# EAGLE design sensorNode1 (EAGLE 9.6.2)
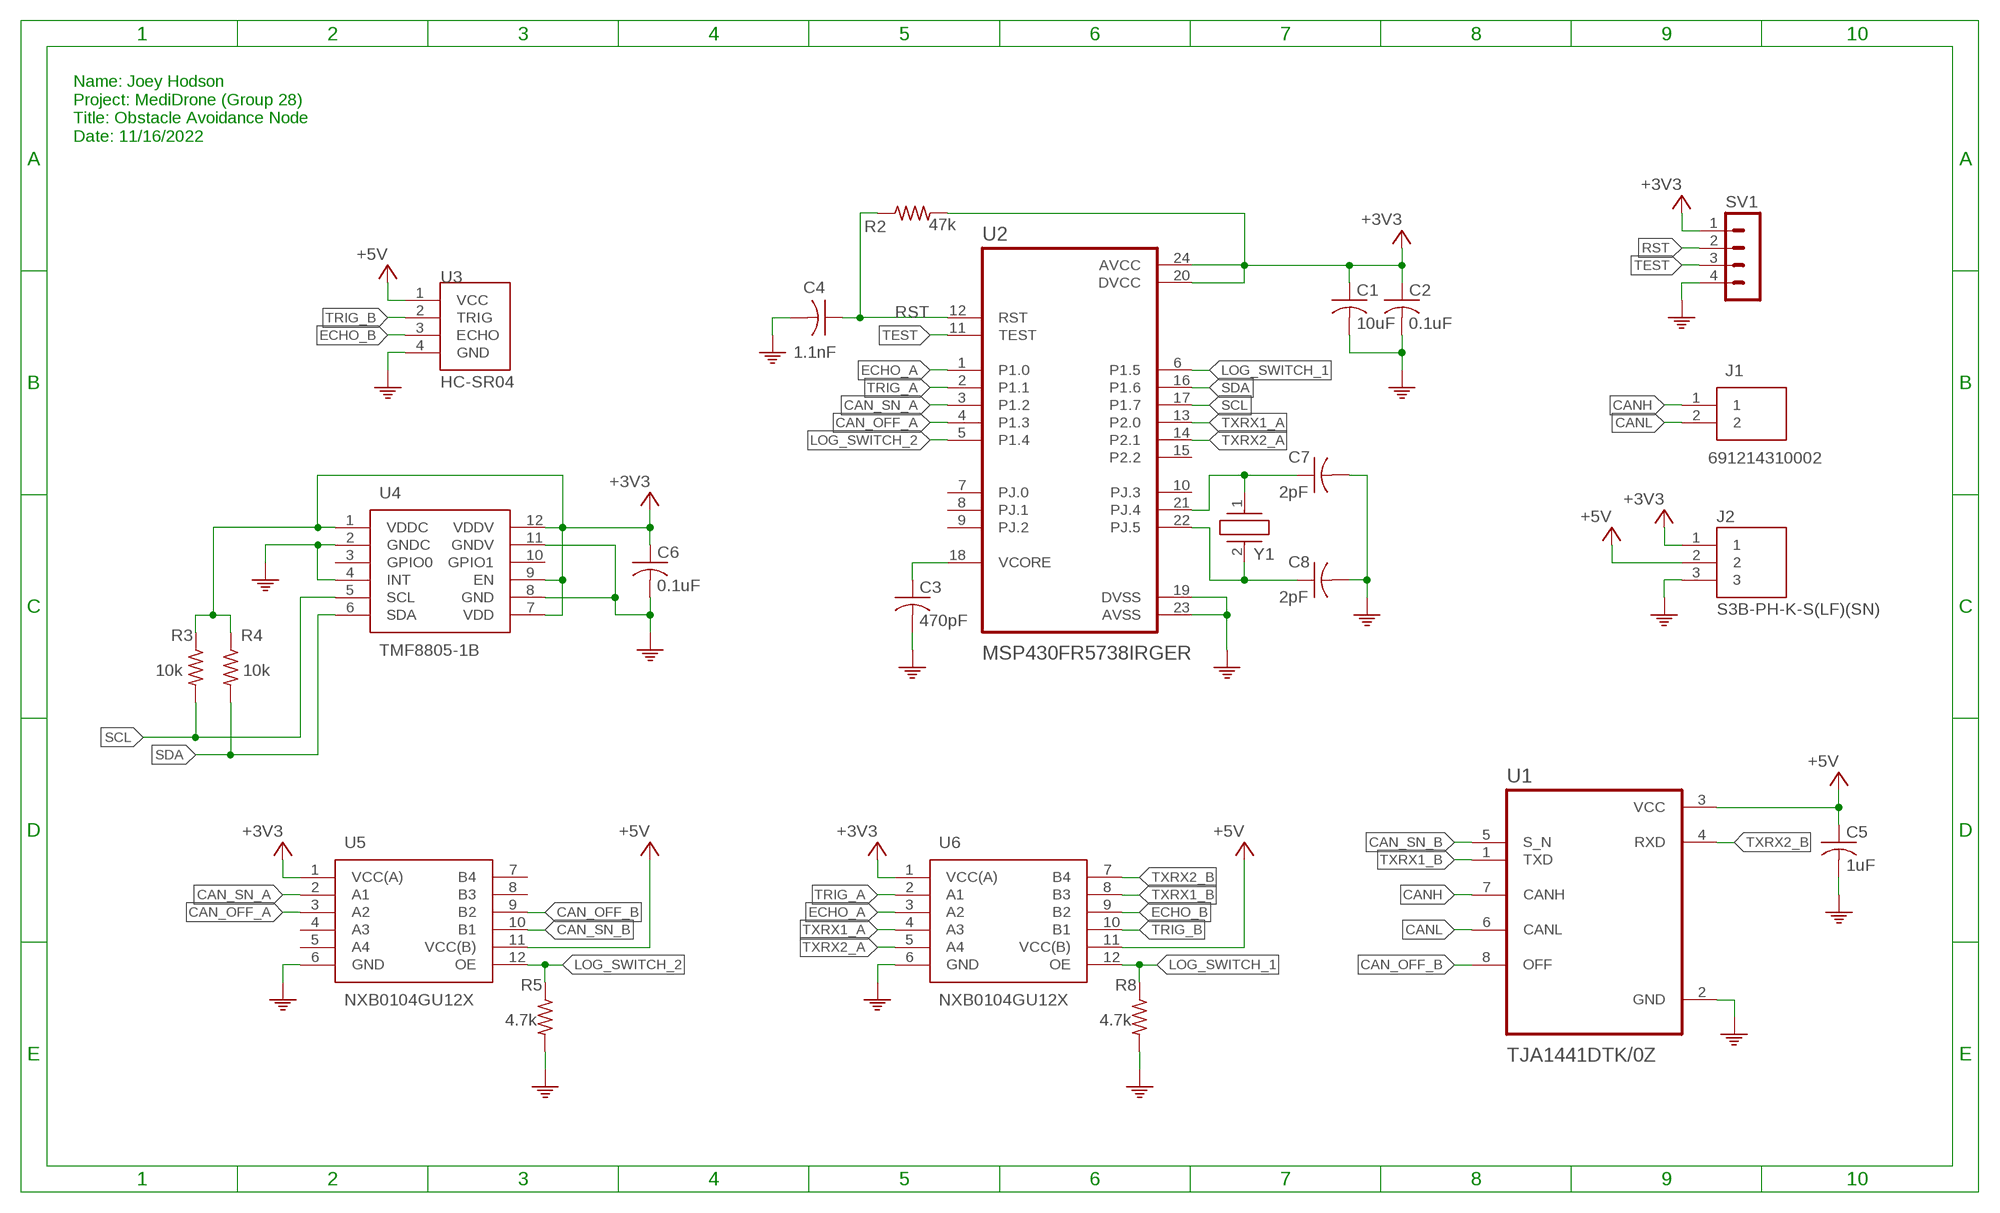
[diagram p0: schematic, sheet 1]

## Parts
C1  10uF  C-USC0805  [C0805]
C2  0.1uF  C-USC0603  [C0603]
C3  470pF  C-USC0603  [C0603]
C4  1.1nF  C-USC0603  [C0603]
C5  1uF  C-USC0603  [C0603]
C6  0.1uF  C-USC0603  [C0603]
C7  2pF  C-USC0603  [C0603]
C8  2pF  C-USC0603  [C0603]
J1  691214310002  [SHDR2W90P0X381_1X2_802X740X850]
J2  S3B-PH-K-S(LF)(SN)  [JST_S3B-PH-K-S(LF)(SN)]
R2  47k  R-US_R0603  [R0603]
R3  10k  R-US_R0603  [R0603]
R4  10k  R-US_R0603  [R0603]
R5  4.7k  R-US_R0603  [R0603]
R8  4.7k  R-US_R0603  [R0603]
SV1  MA04-1  [MA04-1]
U1  TJA1441DTK/0Z  [SON65P300X300X95-8N]
U2  MSP430FR5738IRGER  [QFN50P400X400X100-25N]
U3  HC-SR04  [HC-SR04_VARIANT]
U4  TMF8805-1B  [TMF88051B]
U5  NXB0104GU12X  [NXB0104GU12X]
U6  NXB0104GU12X  [NXB0104GU12X]
Y1  HC-49_U-S16000000ABJB  [HC49]

## Nets
0: C1.2 C2.2 C3.2 C4.2 C5.2 C6.2 C7.2 C8.2 J2.3 R5.2 R8.2 SV1.4 U1.2(GND) U2.19(DVSS) U2.23(AVSS) U3.4(GND) U4.2(GNDC) U4.4(INT) U4.8(GND) U4.11(GNDV) U5.6(GND) U6.6(GND) ; supply symbol labelled PE
+3V3: C1.1 C2.1 C6.1 J2.1 R2.2 R3.1 R4.1 SV1.1 U2.20(DVCC) U2.24(AVCC) U4.1(VDDC) U4.7(VDD) U4.9(EN) U4.12(VDDV) U5.1(VCC(A)) U6.1(VCC(A))
+5V: C5.1 J2.2 U1.3(VCC) U3.1(VCC) U5.11(VCC(B)) U6.11(VCC(B))
CAN_OFF_A: U2.4(P1.3) U5.3(A2)
CAN_OFF_B: U1.8(OFF) U5.9(B2)
CAN_SN_A: U2.3(P1.2) U5.2(A1)
CAN_SN_B: U1.5(S_N) U5.10(B1)
CANH: J1.1 U1.7(CANH)
CANL: J1.2 U1.6(CANL)
ECHO_A: U2.1(P1.0) U6.3(A2)
ECHO_B: U3.3(ECHO) U6.9(B2)
LOG_SWITCH_1: R8.1 U2.6(P1.5) U6.12(OE)
LOG_SWITCH_2: R5.1 U2.5(P1.4) U5.12(OE)
N$2: C3.1 U2.18(VCORE)
N$4: C7.1 U2.21(PJ.4) Y1.1
N$5: C8.1 U2.22(PJ.5) Y1.2
RST: C4.1 R2.1 SV1.2 U2.12(RST)
SCL: R3.2 U2.17(P1.7) U4.5(SCL)
SDA: R4.2 U2.16(P1.6) U4.6(SDA)
TEST: SV1.3 U2.11(TEST)
TRIG_A: U2.2(P1.1) U6.2(A1)
TRIG_B: U3.2(TRIG) U6.10(B1)
TXRX1_A: U2.13(P2.0) U6.4(A3)
TXRX1_B: U1.1(TXD) U6.8(B3)
TXRX2_A: U2.14(P2.1) U6.5(A4)
TXRX2_B: U1.4(RXD) U6.7(B4)
Unconnected: U2.7(PJ.0) U2.8(PJ.1) U2.9(PJ.2) U2.10(PJ.3) U2.15(P2.2) U4.3(GPIO0) U4.10(GPIO1) U5.4(A3) U5.5(A4) U5.7(B4) U5.8(B3)

## Notes on the sheet
- Name: Joey Hodson
  Project: MediDrone (Group 28)
  Title: Obstacle Avoidance Node
  Date: 11/16/2022

## Library data of the parts
C1-C8 = rcl:C-US: CAPACITOR, American symbol; SPICEPREFIX: C
J1 = 691214310002:691214310002: Wurth Elektronik 2143, 2 Way PCB Terminal Block Source: Datasheet <http://uk.rs-online.com/web/p/products/1918756>; DESCRIPTION: Wurth Elektronik 2143, 2 Way PCB Terminal Block; HEIGHT: 8.5mm; MANUFACTURER_NAME: Wurth Elektronik; MANUFACTURER_PART_NUMBER: 691214310002; MOUSER_PART_NUMBER: 710-691214310002; MOUSER_PRICE-STOCK: https://www.mouser.co.uk/ProductDetail/Wurth-Elektronik/691214310002?qs=sPbYRqrBIVnJ8j3in%252B4Wbg%3D%3D
J2 = S3B-PH-K-S_LF__SN_:S3B-PH-K-S(LF)(SN): Connector Header Through Hole, Right Angle 3 position 0.079" (2.00mm) Check availability <https://pricing.snapeda.com/parts/S3B-PH-K-S%28LF%29%28SN%29/JST%20Sales/view-part?ref=eda>; AVAILABILITY: In Stock; DESCRIPTION: Connector Header Through Hole, Right Angle 3 position 0.079 (2.00mm); MF: JST Sales; MP: S3B-PH-K-S(LF)(SN); PACKAGE: None; PRICE: None
R2-R5 R8 = rcl:R-US_: RESISTOR, American symbol; SPICEPREFIX: R
SV1 = con-lstb:MA04-1: PIN HEADER; OC_FARNELL: unknown; OC_NEWARK: unknown
U1 = TJA1441DTK_0Z:TJA1441DTK/0Z: None Check availability <https://pricing.snapeda.com/parts/TJA1441DTK/0Z/NXP%20USA%20Inc./view-part?ref=eda>; AVAILABILITY: In Stock; DESCRIPTION: 1/1 Transceiver Half CAN 8-HVSON (3x3); MF: NXP USA Inc.; MP: TJA1441DTK/0Z; PACKAGE: VDFN-8 NXP Semiconductors; PRICE: None; PURCHASE-URL: https://pricing.snapeda.com/search/part/TJA1441DTK/0Z/?ref=eda
U2 = MSP430FR5738IRGER:MSP430FR5738IRGER: Check availability <https://pricing.snapeda.com/parts/MSP430FR5738IRGER/Texas%20Instruments/view-part?ref=eda>; AVAILABILITY: In Stock; DESCRIPTION: 24 MHz MCU with 16KB FRAM, 1KB SRAM, 10-bit ADC , comparator, UART/SPI/I2C, timer; MF: Texas Instruments; MP: MSP430FR5738IRGER; PACKAGE: QFN-24 Texas Instruments; PRICE: None; PURCHASE-URL: https://pricing.snapeda.com/search/part/MSP430FR5738IRGER/?ref=eda
U3 = HC-SR04_variantFoot:HC-SR04: Ultrasonic Sensor Module Check availability <https://pricing.snapeda.com/parts/HC-SR04/OSEPP%20Electronics/view-part?ref=eda>; AVAILABILITY: In Stock; DESCRIPTION: Multiple Function Sensor Development Tools Ultrasonic Sensor Module; MF: OSEPP Electronics; MP: HC-SR04; PACKAGE: None; PRICE: None; PURCHASE-URL: https://pricing.snapeda.com/search/part/HC-SR04/?ref=eda
U4 = TMF8805-1B:TMF8805-1B: Distance Sensor Development Tool TMF8805-1B OLGA12 LF T&RDP Source: Datasheet <https://ams.com/documents/20143/4372629/TMF8805_DS000692_4-00.pdf>; DESCRIPTION: Distance Sensor Development Tool TMF8805-1B OLGA12 LF T&RDP; HEIGHT: 1.1mm; MANUFACTURER_NAME: ams; MANUFACTURER_PART_NUMBER: TMF8805-1B; MOUSER_PART_NUMBER: 985-TMF8805-1B; MOUSER_PRICE-STOCK: https://www.mouser.co.uk/ProductDetail/ams/TMF8805-1B?qs=sPbYRqrBIVlwsjHE%2F%252BrL9g%3D%3D
U5 U6 = NXB0104GU12X:NXB0104GU12X: NXB0104 - Dual supply translating transceiver; auto direction sensing; 3-state@en-us Source: Datasheet <https://assets.nexperia.com/documents/data-sheet/NXB0104.pdf>; DESCRIPTION: NXB0104 - Dual supply translating transceiver; auto direction sensing; 3-state@en-us; HEIGHT: 0.5mm; MANUFACTURER_NAME: Nexperia; MANUFACTURER_PART_NUMBER: NXB0104GU12X; MOUSER_PART_NUMBER: 771-NXB0104GU12X; MOUSER_PRICE-STOCK: https://www.mouser.co.uk/ProductDetail/Nexperia/NXB0104GU12X?qs=Cb2nCFKsA8qel1LiVuKg%252Bw%3D%3D
Y1 = HC-49_U-S16000000ABJB:HC-49_U-S16000000ABJB: Crystals 16MHz 18pF HC49S THROUGH HOLE Source: Datasheet <http://cfd.citizen.co.jp/english/prod-tech/product/pdf/datasheet_AT/HC-49_U-S_E.pdf>; DESCRIPTION: Crystals 16MHz 18pF HC49S THROUGH HOLE; HEIGHT: mm; MANUFACTURER_NAME: Citizen Finetech Miyota; MANUFACTURER_PART_NUMBER: HC-49/U-S16000000ABJB; MOUSER_PART_NUMBER: 695-HC49US16.0ABJB; MOUSER_PRICE-STOCK: https://www.mouser.co.uk/ProductDetail/Citizen-FineDevice/HC-49-U-S16000000ABJB?qs=byeeYqUIh0M5kN9OYTo1Hw%3D%3D

## Board
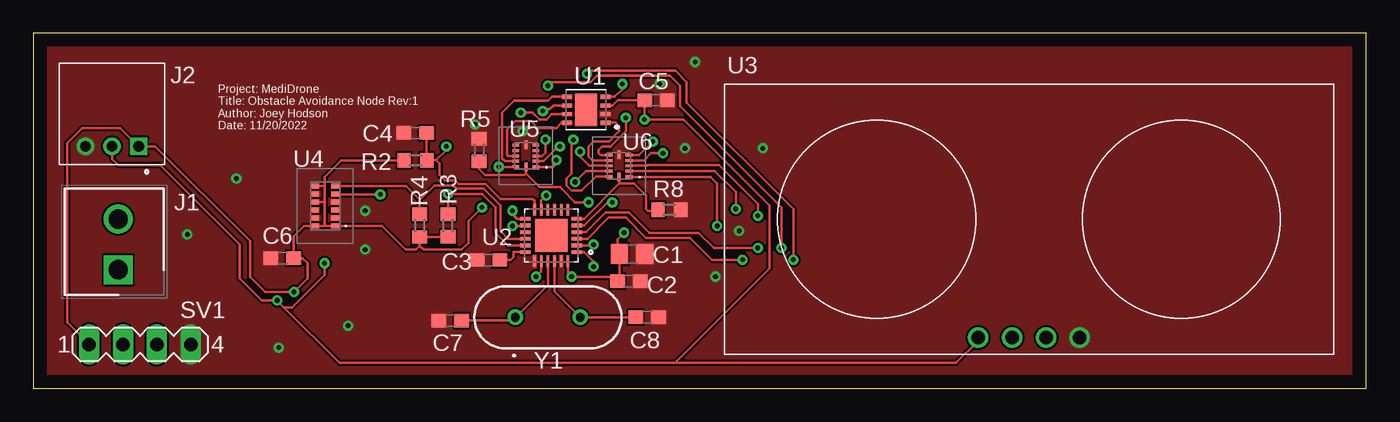
[diagram p1: board, top side]
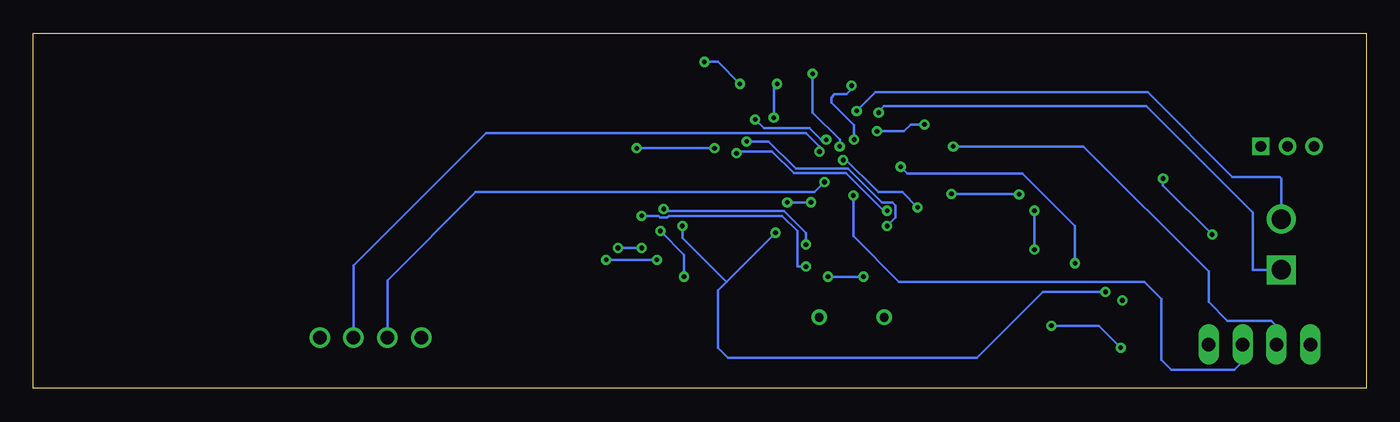
[diagram p2: board, bottom side, seen from below]

Size 100 x 26.66 mm. Coordinates in mm from the lower left corner, seen from the top.
Outline: 0,0 100,0 100,26.66 0,26.66 0,0
Copper layers (1*16): Top 0.035mm / dielectric 1.5mm / Bottom 0.035mm
Design rules "default": minimum track width 6mil, minimum drill 0.35mm, track to track 6mil, track to pad 6mil, pad to pad 6mil, via to via 6mil, smd to smd 6mil, copper to edge 40mil, drill to drill 6mil, minimum pad ring 10mil, minimum via ring 8mil, stop-mask expansion 4mil, vias tented up to drill 0mil, thermal gap 10mil

### Footprints (pad centres in the part's own frame; a part is rotated, then mirrored left to right if it is on the bottom)
C0805 = smd 1.3 x 1.5: 1 -0.95,0; 2 0.95,0
C0603 = smd 1.1 x 1: 1 -0.85,0; 2 0.85,0
SHDR2W90P0X381_1X2_802X740X850 = drill 1.45 pad 2.175 square: 1 0,0 | drill 1.45 pad 2.175: 2 3.81,0
JST_S3B-PH-K-S(LF)(SN) = drill 0.8 square: 1 0,0 | drill 0.8: 2 2,0; 3 4,0
R0603 = smd 1 x 1.1: 1 -0.85,0; 2 0.85,0
MA04-1 = drill 1.016 long: 1 -3.81,0; 2 -1.27,0; 3 1.27,0; 4 3.81,0
SON65P300X300X95-8N = smd 0.84 x 0.32: 1 -1.445,0.975; 2 -1.445,0.325; 3 -1.445,-0.325; 4 -1.445,-0.975; 5 1.445,-0.975; 6 1.445,-0.325; 7 1.445,0.325; 8 1.445,0.975 | smd 1.65 x 2.45: 9 0,0
QFN50P400X400X100-25N = smd 0.86 x 0.27: 1 -1.935,1.25; 2 -1.935,0.75; 3 -1.935,0.25; 4 -1.935,-0.25; 5 -1.935,-0.75; 6 -1.935,-1.25; 13 1.935,-1.25; 14 1.935,-0.75; 15 1.935,-0.25; 16 1.935,0.25; 17 1.935,0.75; 18 1.935,1.25 | smd 0.27 x 0.86: 7 -1.25,-1.935; 8 -0.75,-1.935; 9 -0.25,-1.935; 10 0.25,-1.935; 11 0.75,-1.935; 12 1.25,-1.935; 19 1.25,1.935; 20 0.75,1.935; 21 0.25,1.935; 22 -0.25,1.935; 23 -0.75,1.935; 24 -1.25,1.935 | smd 2.45 x 2.45: 25 0,0
HC-SR04_VARIANT = drill 1.02: 1 -3.81,-3.81; 2 -1.27,-3.81; 3 1.27,-3.81; 4 3.81,-3.81
TMF88051B = smd 0.35 x 0.575: 1 -1.5,-0.738; 2 -0.9,-0.738; 3 -0.3,-0.738; 4 0.3,-0.738; 5 0.9,-0.738; 6 1.5,-0.738; 7 1.5,0.738; 8 0.9,0.738; 9 0.3,0.738; 10 -0.3,0.738; 11 -0.9,0.738; 12 -1.5,0.738
NXB0104GU12X = smd 0.5 x 0.32: 1 -0.75,0.85 | smd 0.5 x 0.22: 2 -0.75,0.4; 3 -0.75,0; 4 -0.75,-0.4; 5 -0.75,-0.8; 7 0.75,-0.8; 8 0.75,-0.4; 9 0.75,0; 10 0.75,0.4; 11 0.75,0.8 | smd 0.22 x 0.65: 6 0,-0.825; 12 0,0.825
HC49 = drill 0.65 pad 1.1: 1 -2.44,0; 2 2.44,0

### Placement (x,y rotation side)
C1  44.94,10.09 0 top
C2  44.68,8.04 0 top
C3  34.14,9.64 180 top
C4  28.66,19.17 180 top
C5  46.72,21.63 0 top
C6  18.68,9.77 180 top
C7  31.28,5.1 180 top
C8  46.05,5.34 0 top
J1  6.37,8.9 90 top
J2  7.9,18.17 180 top
R2  28.66,17.12 180 top
R3  31.11,12.23 90 top
R4  28.98,12.21 90 top
R5  33.45,17.89 90 top
R8  47.72,13.41 0 top
SV1  8,3.3 0 top
U1  41.48,20.91 180 top
U2  38.85,11.48 180 top
U3  74.7,7.62 0 top
U4  21.9,13.7 90 top
U5  36.96,17.45 180 top
U6  43.94,16.71 180 top
Y1  38.61,5.33 0 top

### Tracks (layer width: path | path; a pad name or v marks a point on that pad's centre or on a via)
0  (via drill 0.35)
  Bottom 0.2: v36.7,19.3 34.67,19.3 34.16,19.81 v33.15,19.81 | v48.89,18.03 v54.74,18.03 | v46.99,22.86 48.64,24.51 v49.66,24.51 | v52.96,11.81 51.18,10.03 v51.18,8.38 | v24.89,13.34 v24.89,10.41 | v18.41,3.05 20.07,4.7 v23.62,4.7 | v11.56,11.56 15.24,15.24 v15.24,15.75
  pour Top (no thermals): 0,26.67 0,0 100.08,0 100.08,26.67
+3V3  (via drill 0.35)
  Top 0.2: R3.1 31.09,11.36 R4.1 28.98,10.7 | U2.20 38.1,8.89 38.1,8.76 v37.72,8.38 | C2.1 43.72,8.16 | 43.72,8.16 43.49,8.38 v40.39,8.38 40.1,8.67 U2.24 | 28.98,10.7 28.7,10.41 27.94,10.41 26.16,12.2 U4.1 21.84,12.2 | v44.32,11.68 43.81,11.18 43.81,10.26 C1.1 43.98,8.43 43.72,8.16 | U6.1 44.7,15.88 50.81,15.88 51.31,15.38 v51.31,12.19 | U5.1 38.95,16.6 39.24,16.89 v39.24,17.14 | R2.2 23.09,17.12 21.84,15.88 21.84,15.24 | 28.98,10.7 29.27,10.41 32.13,10.41 32.64,10.92 32.64,12.57 v33.65,13.59 | 21.84,12.2 U4.12 20.32,12.2 19.53,11.4 C6.1 20.2,9.77 20.57,9.4 20.57,8.26 v19.56,7.24 17.4,7.24 16.26,8.38 16.26,11.05 9.13,18.17 J2.1 6.52,19.56 3.68,19.56 2.54,18.41 2.54,4.95 SV1.1 | 21.84,15.24 21.84,13.97 | 21.84,13.97 21.84,12.2 | 21.84,13.97 21.82,14 U4.9 | U4.7 21.8,15.2 21.84,15.24
  Bottom 0.2: v37.72,8.38 v40.39,8.38 | v19.56,7.24 24.26,7.24 29.21,2.29 47.88,2.29 48.64,3.05 48.64,7.37 48.01,8 | v44.32,11.68 48.01,8 | 48.01,8 51.31,11.3 v51.31,12.19 | v33.65,13.59 34.8,14.73 36.59,14.73 39.24,17.38 v39.24,17.14
+5V  (via drill 0.35)
  Top 0.2: U6.11 42.2,15.91 41.14,14.86 40.38,14.86 40.01,15.23 40.01,15.76 40.39,16.14 40.39,18.55 v40.51,18.67 | J2.2 5.9,17.21 6.35,16.76 9.53,16.76 15.49,10.79 15.49,8.26 17.14,6.6 v18.29,6.6 18.8,6.1 | v21.84,9.4 21.84,8.51 19.43,6.1 18.8,6.1 | v34.92,16.63 36.19,16.63 U5.11 | 18.8,6.1 22.99,1.91 48.13,1.91 | 48.13,1.91 69.22,1.91 70.89,3.58 U3.1 | 48.13,1.91 55.24,9.02 55.24,13.72 48.77,20.19 v45.85,20.19 45.87,20.21 C5.1 43.85,21.63 43.46,21.24 U1.3
  Bottom 0.2: v21.84,9.4 21.84,12.19 25.78,16.13 34.42,16.13 v34.92,16.63 | v40.51,18.67 40.89,18.67 41.75,19.53 45.18,19.53 v45.85,20.19
CAN_OFF_A  (via drill 0.35)
  Top 0.2: U5.3 38.15,17.45 38.42,17.72 v38.42,18.67 | v54.36,10.54 51.05,10.54 49.91,11.68 49.78,11.68 49.75,11.65 46.25,11.65 45.11,12.79 45.11,12.8 44.7,13.21 42.93,13.21 41.45,11.73 U2.4 | v56.13,10.54 56.13,13.59 48.51,21.21 48.51,22.73 47.76,23.49 42.29,23.49 41.79,22.99 38.88,22.99 v38.61,22.73
  Bottom 0.2: v54.36,10.54 v56.13,10.54 | v38.42,18.67 38.42,19.75 40.13,21.46 40.13,21.84 39.88,22.1 38.99,22.1 38.61,22.48 v38.61,22.73
CAN_OFF_B
  Top 0.2: U5.9 35.63,17.45 35.56,17.53 35.56,19.43 36.19,20.06 37.34,20.06 37.85,19.56 39.24,19.56 39.62,19.94 U1.8
CAN_SN_A  (via drill 0.35)
  Top 0.2: U2.3 41.58,11.23 43.17,12.82 44.46,12.82 45.98,11.3 49.28,11.3 50.93,9.65 v53.21,9.65 | U5.2 38.26,17.05 39.37,18.16 v39.5,18.16 | v57.02,9.65 57.02,13.46 49.02,21.46 49.02,22.99 48.17,23.84 41.75,23.84 v41.53,23.62
  Bottom 0.2: v53.21,9.65 v57.02,9.65 | v41.53,23.62 41.53,20.7 39.5,18.67 v39.5,18.16
CAN_SN_B
  Top 0.2: U5.10 35.4,17.05 35.18,17.27 35.18,20.7 36.07,21.59 38.61,21.59 38.91,21.89 U1.5
CANH  (via drill 0.35)
  Top 0.2: v36.58,20.7 37.46,20.7 37.6,20.57 37.97,20.2 38.49,20.2 38.88,20.59 U1.7
  Bottom 0.2: J1.1 6.38,8.89 8.51,8.89 8.51,13.21 16.51,21.21 36.2,21.21 36.58,20.83 v36.58,20.7
CANL  (via drill 0.35)
  Top 0.2: U1.6 39.02,21.24 38.73,20.95 38.23,20.95 v38.23,20.83
  Bottom 0.2: v38.23,20.83 36.83,22.23 16.38,22.23 10.03,15.88 6.48,15.88 6.37,15.77 J1.2
ECHO_A  (via drill 0.35)
  Top 0.2: U2.1 41.33,10.23 42.04,9.53 v42.04,9.14 | U6.3 46.05,16.71 46.1,16.76 51.44,16.76 54.36,13.84 v54.36,12.95
  Bottom 0.2: v42.04,9.14 42.67,9.14 42.67,11.81 43.81,12.95 52.32,12.95 52.44,12.83 52.97,12.83 53.09,12.95 v54.36,12.95
ECHO_B  (via drill 0.35)
  Top 0.2: U6.9 41.71,16.71 41.02,17.4 v41.02,17.78
  Bottom 0.2: U3.3 75.97,9.24 66.04,19.18 42.04,19.18 41.02,18.16 v41.02,17.78
LOG_SWITCH_1
  Top 0.2: U2.6 41.31,12.73 43.94,15.37 | U6.12 43.94,15.37 | 43.94,15.37 45.08,15.37 45.97,14.48 45.97,13.46 46.1,13.34 46.79,13.34 R8.1
LOG_SWITCH_2  (via drill 0.35)
  Top 0.2: R5.1 33.45,16.46 33.91,16 36.83,16 36.96,16.13 | U5.12 36.96,16.13 | U2.5 41.33,12.23 43.07,13.97 v43.43,13.97 | v41.65,13.97 40.64,13.97 39.62,14.99 39.63,14.99 39.5,15.11 37.98,15.11 36.96,16.13
  Bottom 0.2: v43.43,13.97 v41.66,13.97 v41.65,13.97
N$2
  Top 0.2: U2.18 36.01,10.23 36.01,9.85 35.8,9.64 C3.1
N$4
  Top 0.2: U2.21 38.6,7.77 Y1.1 35.93,5.1 C7.1
N$5
  Top 0.2: U2.22 39.1,7.28 Y1.2 C8.1
RST  (via drill 0.35)
  Top 0.2: C4.1 R2.1 29.54,17.14 30.23,17.14 | U2.12 37.59,14.1 37.46,14.22 35.04,14.22 33.93,15.34 31.9,15.34 31.64,15.59 30.89,15.59 30.48,16 30.48,16.89 30.23,17.14 | v30.99,18.16 30.99,17.91 30.23,17.14
  Bottom 0.2: v30.99,18.16 21.21,18.16 11.81,8.76 11.81,6.48 10.41,5.08 7.11,5.08 6.6,4.57 6.6,3.42 SV1.2
SCL  (via drill 0.35)
  Top 0.2: R3.2 v31.11,14.6 v31.11,14.61 33.65,14.61 34.67,13.59 34.67,11.68 35.62,10.73 U2.17 | v26.04,14.56 22.67,14.56 U4.5
  Bottom 0.2: v31.11,14.61 26.07,14.61 v26.04,14.56
SDA
  Top 0.2: R4.2 28.98,13.69 28.98,14.12 | 28.98,14.12 28.98,14.2 27.98,15.2 U4.6 | U2.16 35.63,11.23 35.05,11.81 35.05,13.72 33.78,14.99 31.75,14.99 31.5,15.24 30.1,15.24 28.98,14.12
TEST  (via drill 0.35)
  Top 0.2: U2.11 38.1,14.1 v38.48,14.48
  Bottom 0.2: v38.48,14.48 38.48,11.43 35.05,8 16.64,8 15.37,6.73 15.37,2.16 14.61,1.4 9.91,1.4 9.27,2.03 SV1.3
TRIG_A  (via drill 0.35)
  Top 0.2: v52.7,13.46 52.7,14.73 51.12,16.31 U6.2 | v42.04,10.79 41.97,10.73 U2.2
  Bottom 0.2: v52.7,13.46 52.58,13.34 43.69,13.34 42.04,11.68 v42.04,10.79
TRIG_B  (via drill 0.35)
  Top 0.2: U6.10 41.46,16.31 v40.64,15.49
  Bottom 0.2: v40.64,15.49 41.4,14.73 66.8,14.73 73.43,8.1 U3.2
TXRX1_A  (via drill 0.35)
  Top 0.2: U2.13 36.29,12.73 36.2,12.82 35.94,13.08 v35.94,13.34 | U6.4 45.81,17.11 46.35,17.65 v47.24,17.65
  Bottom 0.2: v35.94,13.34 36.2,13.34 39.02,16.16 42.95,16.16 44.57,17.78 47.12,17.78 v47.24,17.65
TXRX1_B
  Top 0.2: U6.8 41.94,17.11 41.66,17.4 41.66,18.16 42.04,18.54 43.18,18.54 43.94,19.3 43.94,19.68 43.69,19.94 U1.1
TXRX2_A  (via drill 0.35)
  Top 0.2: U2.14 36.88,12.19 v35.94,12.19 | U6.5 45.45,17.51 v46.48,18.54
  Bottom 0.2: v35.94,12.19 35.31,12.83 35.31,13.72 35.56,13.97 36.33,13.97 38.87,16.51 42.8,16.51 44.83,18.54 v46.48,18.54
TXRX2_B  (via drill 0.35)
  Top 0.2: U6.7 42.56,17.51 42.42,17.65 42.42,17.91 42.67,18.16 43.31,18.16 44.45,19.3 v44.45,20.32 | U1.4 43.61,21.89 44.2,22.48 v44.2,22.86
  Bottom 0.2: v44.45,20.32 44.45,22.61 v44.2,22.86

### Text on the board
tPlace: Project: MediDrone / Title: Obstacle Avoidance Node Rev:1 / Author: Joey Hodson / Date: 11/20/2022